# EAGLE design servo-pyro (EAGLE 7.4.0)
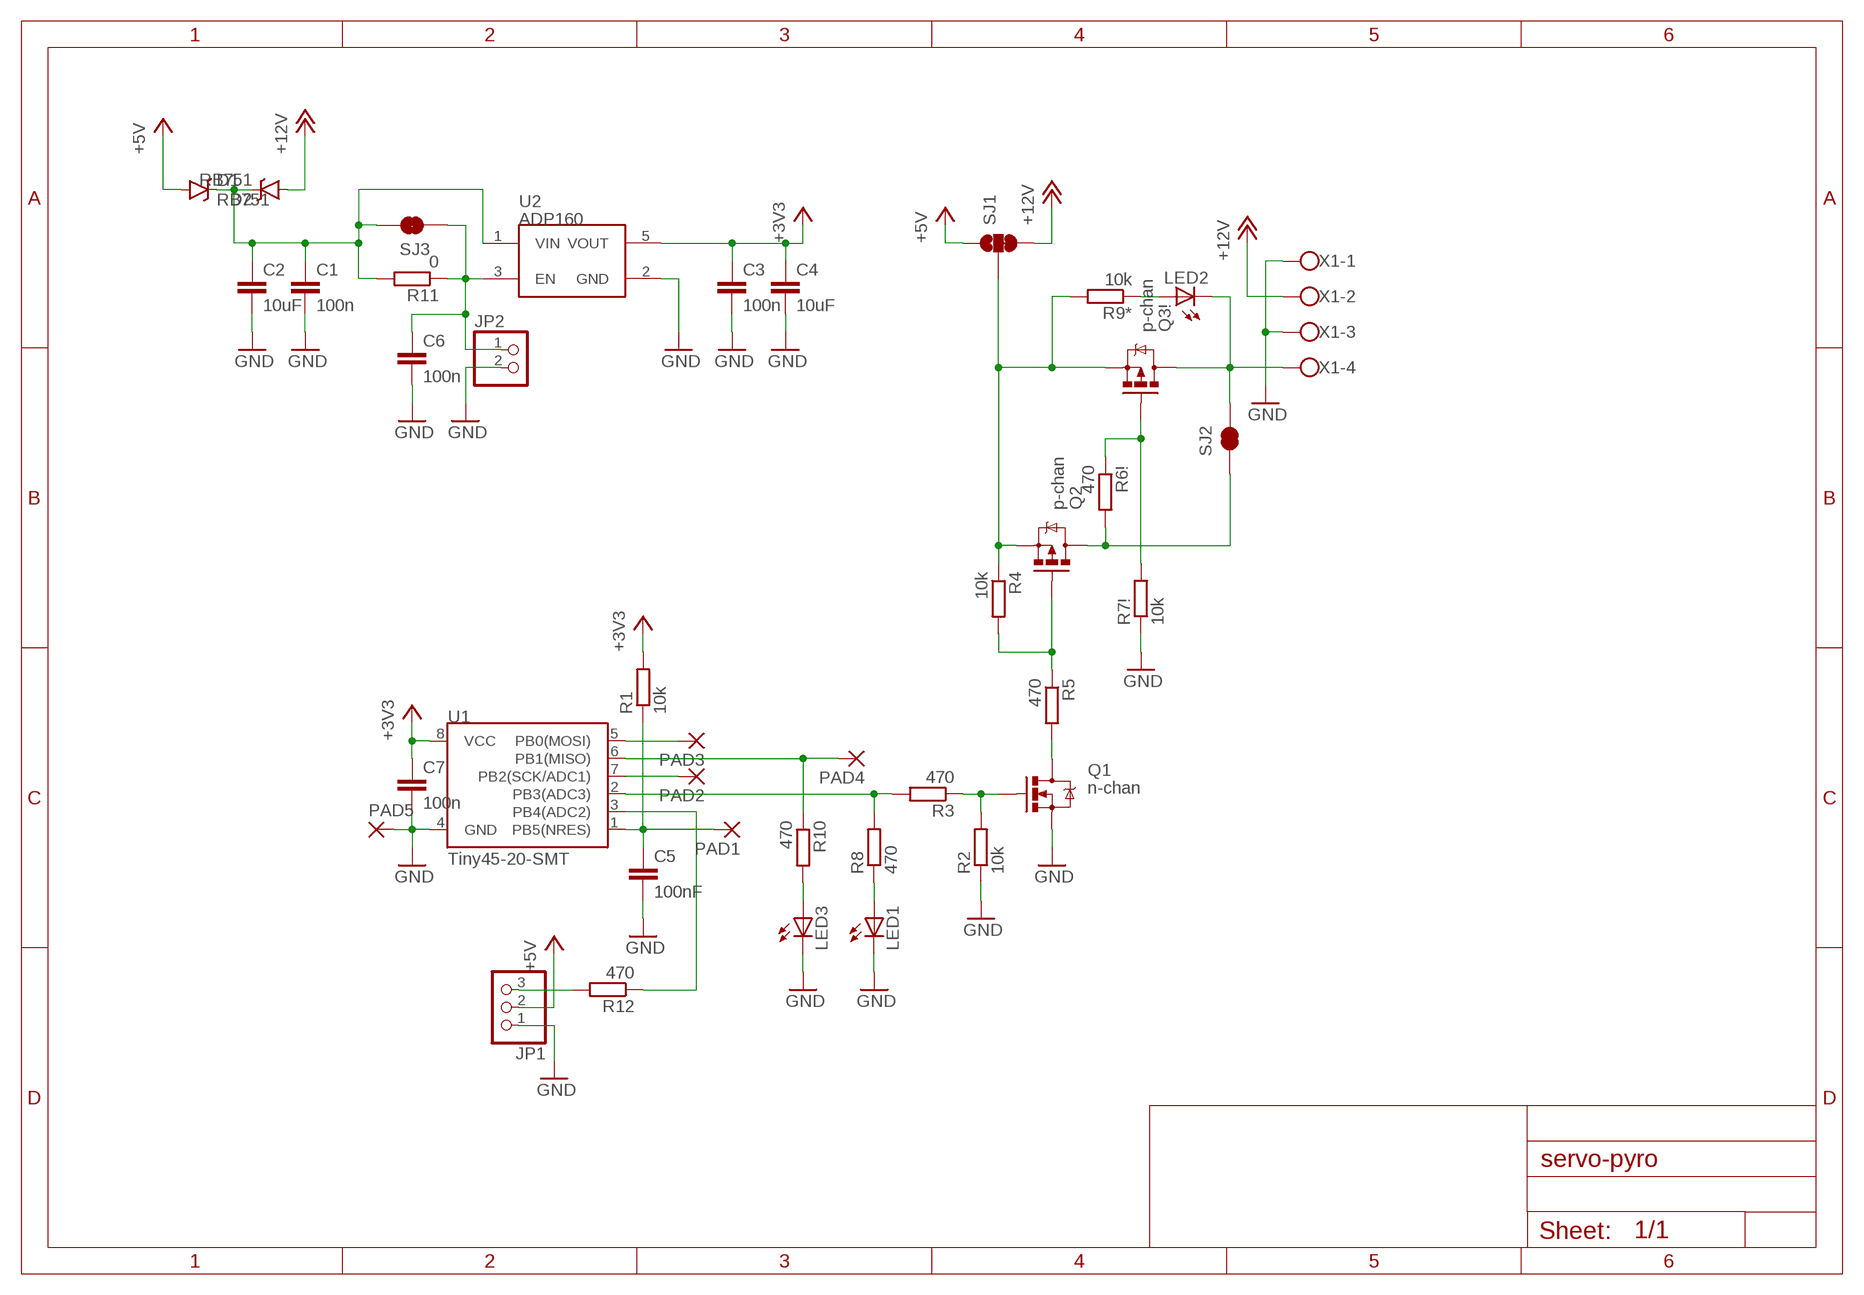
[diagram p0: schematic, sheet 1]

## Parts
C1  100n  C-EUC0603K  [C0603K]
C2  10uF  C-EUC0603K  [C0603K]
C3  100n  C-EUC0603K  [C0603K]
C4  10uF  C-EUC0603K  [C0603K]
C5  100nF  C-EUC0603K  [C0603K]
C6  100n  C-EUC0603K  [C0603K]
C7  100n  C-EUC0603K  [C0603K]
D1  RB751  DIODE-SCHOTTKY-RB751  [SOD-523]
D2  RB751  DIODE-SCHOTTKY-RB751  [SOD-523]
JP1  PINHD-1X3  [1X03]
JP2  PINHD-1X2  [1X02]
LED1  LEDCHIPLED_0603  [CHIPLED_0603]
LED2  LEDCHIPLED_0603  [CHIPLED_0603]
LED3  LEDCHIPLED_0603  [CHIPLED_0603]
PAD1  1,6/0,8  [1,6/0,8]
PAD2  1,6/0,8  [1,6/0,8]
PAD3  1,6/0,8  [1,6/0,8]
PAD4  1,6/0,8  [1,6/0,8]
PAD5  1,6/0,8  [1,6/0,8]
Q1  n-chan  MOSFET-NCHANNELBSS123LT1G  [SOT23-3]
Q2  p-chan  MOSFET-PCHANNELSMD  [SOT23-3]
Q3!  p-chan  MOSFET-PCHANNELSMD  [SOT23-3]
R1  10k  R-EU_R0603  [R0603]
R2  10k  R-EU_R0603  [R0603]
R3  470  R-EU_R0603  [R0603]
R4  10k  R-EU_R0603  [R0603]
R5  470  R-EU_R0603  [R0603]
R6!  470  R-EU_R0603  [R0603]
R7!  10k  R-EU_R0603  [R0603]
R8  470  R-EU_R0603  [R0603]
R9*  10k  R-EU_R0603  [R0603]
R10  470  R-EU_R0603  [R0603]
R11  0  R-EU_R0603  [R0603]
R12  470  R-EU_R0603  [R0603]
SJ1  JUMPER-PAD-3-2OF3_NC_BY_TRACE_LARGE  [PAD-JUMPER-3-2OF3_NC_BY_TRACE_YES_SILK_LARGE]
SJ2  JUMPER-PAD-2-NC_BY_TRACENO_SILK  [PAD-JUMPER-2-NC_BY_TRACE_NO_SILK]
SJ3  JUMPER-PAD-2-NC_BY_TRACENO_SILK  [PAD-JUMPER-2-NC_BY_TRACE_NO_SILK]
U1  Tiny45-20-SMT  ATTINY45TINY45-20-SMT  [SO08-EIAJ]
U2  ADP160  [SOT23-5]
X1  W237-4  [W237-4]

## Nets
+3V3: C3.1 C4.1 C7.1 R1.2 U1.8(VCC) U2.5(VOUT)
+5V: D1.A JP1.2 SJ1.1
+12V: D2.A SJ1.3 X1.2
GND: C1.2 C2.2 C3.2 C4.2 C5.2 C6.2 C7.2 JP1.1 JP2.2 LED1.C LED3.C PAD5.1(P) Q1.2(S) R2.1 R7!.1 U1.4(GND) U2.2(GND) X1.1 X1.3
N$1: C5.1 PAD1.1(P) R1.1 U1.1(PB5(NRES))
N$2: C6.1 JP2.1 R11.1 SJ3.1 U2.3(EN)
N$3: LED2.A R9*.1
N$4: C1.1 C2.1 D1.C D2.C R11.2 SJ3.2 U2.1(VIN)
N$5: PAD2.1(P) U1.7(PB2(SCK/ADC1))
N$6: PAD3.1(P) U1.5(PB0(MOSI))
N$7: Q3!.1(G) R6!.1 R7!.2
N$8: Q2.1(G) R4.2 R5.1
N$11: Q1.1(G) R2.2 R3.1
N$12: Q1.3(D) R5.2
N$16: LED1.A R8.1
N$17: R3.2 R8.2 U1.2(PB3(ADC3))
N$18: LED3.A R10.2
N$19: JP1.3 R12.2
N$20: R12.1 U1.3(PB4(ADC2))
N$21: PAD4.1(P) R10.1 U1.6(PB1(MISO))
PWR_IN: Q2.2(S) Q3!.2(S) R4.1 R9*.2 SJ1.2
PWR_ON: Q2.3(D) R6!.2 SJ2.1
PWR_OUT: LED2.C Q3!.3(D) SJ2.2 X1.4

## Library data of the parts
C1-C7 = rcl:C-EU: CAPACITOR, European symbol
D1 D2 = SparkFun-DiscreteSemi:DIODE-SCHOTTKY: Schottky diodes in SFE's production catalog BAT20J 1A 23V 0.62Vf RB751 120mA 40V 0.37Vf PMEG4005EJ 0.5A 40V 0.42Vf MBRA140 1A 40V 0.5Vf B340A 3A 40V SMA; PROD_ID: DIO-11018
JP1 = pinhead:PINHD-1X3: PIN HEADER
JP2 = pinhead:PINHD-1X2: PIN HEADER
LED1-LED3 = led:LED: LED OSRAM: - CHIPLED LG R971, LG N971, LY N971, LG Q971, LY Q971, LO R971, LY R971 LH N974, LH R974 LS Q976, LO Q976, LY Q976 LO Q996 - Hyper CHIPLED LW Q18S LB Q993, LB Q99A, LB R99A - SideLED LS A670, LO A670, LY A670, LG A670, LP A670 LB A673, LV A673, LT A673, LW A673 LH A674 LY A675 LS A676, LA A676, LO A676, LY A676, LW A676 LS A679, LY A679, LG A679 - Hyper Micro SIDELED® LS Y876, LA Y876, LO Y876, LY Y876 LT Y87S - SmartLED LW L88C, LW L88S LB L89C, LB L89S, LG L890 LS L89K, LO L89K, LY L89K LS L896, LA L896, LO L896, LY L896 - TOPLED LS T670, LO T670, LY T670, LG T670, LP T670 LSG T670, LSP T670, LSY T670, LOP T670, LYG T670 LG T671, LOG T671, LSG T671 LB T673, LV T673, LT T673, LW T673 LH T674 LS T676, LA T676, LO T676, LY T676, LB T676, LH T676, LSB T676, LW T676 LB T67C, LV T67C, LT T67C, LS T67K, LO T67K, LY T67K, LW E67C LS E67B, LA E67B, LO E67B, LY E67B, LB E67C, LV E67C, LT E67C LW T67C LS T679, LY T679, LG T679 LS T770, LO T770, LY T770, LG T770, LP T770 LB T773, LV T773, LT T773, LW T773 LH T774 LS E675, LA E675, LY E675, LS T675 LS T776, LA T776, LO T776, LY T776, LB T776 LHGB T686 LT T68C, LB T68C - Hyper Mini TOPLED® LB M676 - Mini TOPLED Santana® LG M470 LS M47K, LO M47K, LY M47K Source: http://www.osram.convergy.de LUXEON: - LUMILED® LXK2-PW12-R00, LXK2-PW12-S00, LXK2-PW14-U00, LXK2-PW14-V00 LXK2-PM12-R00, LXK2-PM12-S00, LXK2-PM14-U00 LXK2-PE12-Q00, LXK2-PE12-R00, LXK2-PE12-S00, LXK2-PE14-T00, LXK2-PE14-U00 LXK2-PB12-K00, LXK2-PB12-L00, LXK2-PB12-M00, LXK2-PB14-N00, LXK2-PB14-P00, LXK2-PB14-Q00 LXK2-PR12-L00, LXK2-PR12-M00, LXK2-PR14-Q00, LXK2-PR14-R00 LXK2-PD12-Q00, LXK2-PD12-R00, LXK2-PD12-S00 LXK2-PH12-R00, LXK2-PH12-S00 LXK2-PL12-P00, LXK2-PL12-Q00, LXK2-PL12-R00 Source: www.luxeon.com KINGBRIGHT: KA-3528ASYC Source: www.kingbright.com
PAD1-PAD5 = wirepad:1,6/0,8: THROUGH-HOLE PAD
Q1 = SparkFun-DiscreteSemi:MOSFET-NCHANNEL: Common NMOSFET Parts MFG P/N Store ID Prod ID FDD8780 TRANS-09984 SI7820DN TRANS-11055 FDS6630A IC-08089 2N7002PW TRANS-11151 FQP30N06L COM-10213 TRANS-10060 BSS123LT1G TRANS-08345 BSS138 TRANS-00830 BS170 2N7000; PROD_ID: TRANS-08345
Q2 Q3! = SparkFun-DiscreteSemi:MOSFET-PCHANNEL: Generic PMOSFET IRLML2244 - TRANS-11153 (SOT-23 -20V -4.3A) (1.Gate 2.Source 3.Drain) FQP27P06 - COM-10349 <http://www.sparkfun.com/products/10349> (TO-220 -60V -27A) (1.Gate 2.Source 3.Drain)
R1-R5 R6! R7! R8 R9* R10-R12 = rcl:R-EU_: RESISTOR, European symbol
SJ1 = SparkFun-Passives:JUMPER-PAD-3-2OF3_NC_BY_TRACE
SJ2 SJ3 = SparkFun-Passives:JUMPER-PAD-2-NC_BY_TRACE
U1 = SparkFun-DigitalIC:ATTINY45: Atmel 8-pin 2/4/8kB flash uC; PROD_ID: IC-08922
U2 = SparkFun-PowerIC:ADP160: Nanopower LDO Iq less than 1uA for low Iload; PROD_ID: VREG-11306
X1 = con-wago-500:W237-4: WAGO SCREW CLAMP; OC_FARNELL: unknown; OC_NEWARK: unknown

## Board
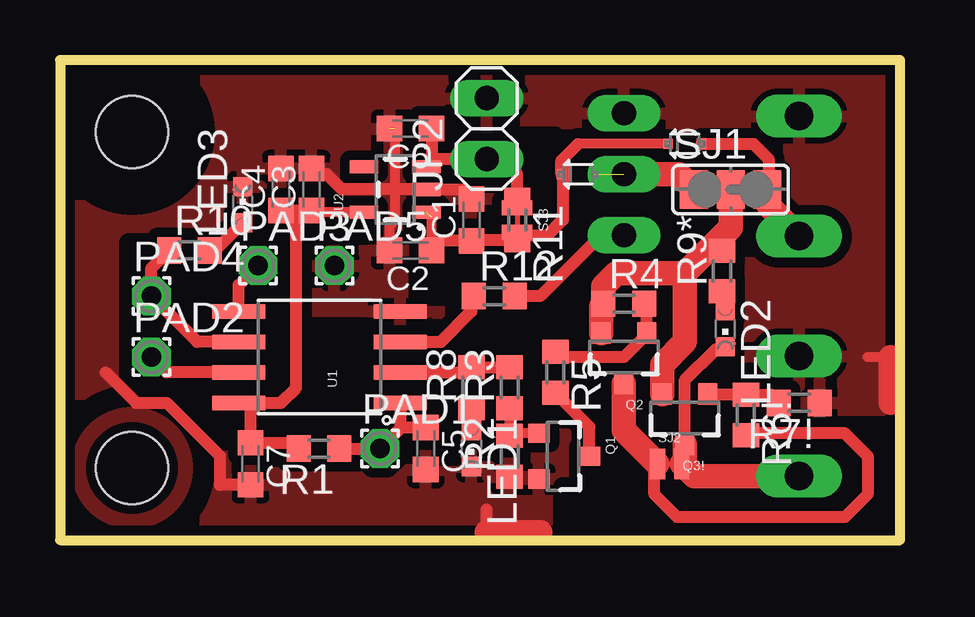
[diagram p1: board, top side]
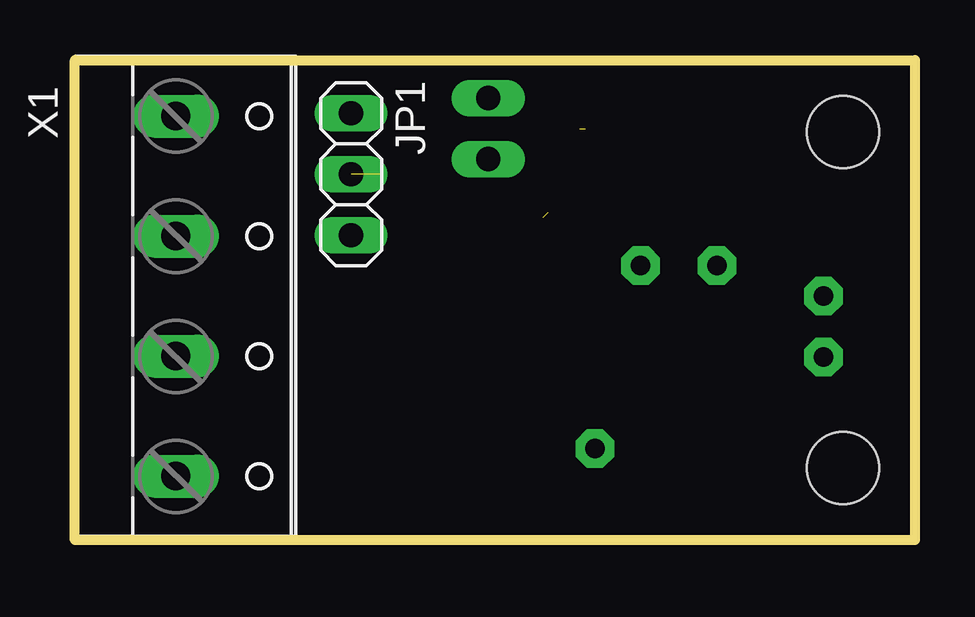
[diagram p2: board, bottom side, seen from below]

Size 35 x 20 mm. Coordinates in mm from the lower left corner, seen from the top.
Outline: 0,0 35,0 35,20 0,20 0,0
Copper layers (1*16): Top 0.035mm / dielectric 1.5mm / Bottom 0.035mm
Design rules "default *": minimum track width 10mil, minimum drill 24mil, track to track 8mil, track to pad 8mil, pad to pad 8mil, via to via 8mil, smd to smd 8mil, copper to edge 10mil, drill to drill 8mil, minimum pad ring 10mil, minimum via ring 8mil, stop-mask expansion 4mil, vias tented up to drill 0mil, thermal gap 10mil
Holes 3 mm at 3,17 3,3
tRestrict: area 0,14 to 6,20; area 0,0 to 6,6; area 10.2,5.7 to 12.7,8.9; area 19.4,15.9 to 20.6,16.8; area 14.3,16.8 to 14.6,17.5; area 10.5,14 to 11.4,14.6; area 15.9,3.5 to 16.5,4.1; area 14.9,10.2 to 16.2,11.1; area 6.3,4.1 to 7.6,5.4; area 2.9,6.3 to 5.1,12.4; area 11.1,12.7 to 12.7,13.3; area 32.7,3.8 to 34.6,4.8; 1 more areas

### Footprints (pad centres in the part's own frame; a part is rotated, then mirrored left to right if it is on the bottom)
C0603K = smd 1.05 x 1.08: 1 -0.875,0; 2 0.875,0
SOD-523 = smd 0.4 x 0.4: A -0.7,0; C 0.7,0
1X03 = drill 1.016 long: 1 -2.54,0; 2 0,0; 3 2.54,0
1X02 = drill 1.016 long: 1 -1.27,0; 2 1.27,0
CHIPLED_0603 = smd 0.8 x 0.8: A 0,-0.75; C 0,0.75
1,6/0,8 = drill 0.813 pad 1.6 octagon: 1 0,0
SOT23-3 = smd 0.8 x 0.9: 1 -0.95,-1; 2 0.95,-1; 3 0,1.1
R0603 = smd 1 x 1.1: 1 -0.85,0; 2 0.85,0
PAD-JUMPER-3-2OF3_NC_BY_TRACE_YES_SILK_LARGE = smd 1.168 x 1.6: 1 -1.524,0; 2 0,0; 3 1.524,0
PAD-JUMPER-2-NC_BY_TRACE_NO_SILK = smd 0.635 x 1.27: 1 -0.508,0; 2 0.508,0
SO08-EIAJ = smd 0.61 x 2.21: 1 -1.905,-3.378; 2 -0.635,-3.378; 3 0.635,-3.378; 4 1.905,-3.378; 5 1.905,3.353; 6 0.635,3.353; 7 -0.635,3.353; 8 -1.905,3.353
SOT23-5 = smd 0.55 x 1.2: 1 -0.95,-1.3; 2 0,-1.3; 3 0.95,-1.3; 4 0.95,1.3; 5 -0.95,1.3
W237-4 = drill 1.194 long: 1 -7.5,-1.27; 2 -2.5,-1.27; 3 2.5,-1.27; 4 7.5,-1.27

### Placement (x,y rotation side)
C1  17.14,13.34 90 top
C2  14.61,12.06 180 top
C3  10.48,14.61 90 top
C4  9.21,14.61 90 top
C5  15.24,3.81 270 top
C6  14.61,17.14 180 top
C7  7.94,3.17 270 top
D1  21.59,15.24 180 top
D2  26.04,16.51 180 top
JP1  23.5,15.24 270 bottom
JP2  17.78,17.14 90 top
LED1  17.14,3.81 180 top
LED2  27.72,8.8 180 top
LED3  7.62,13.97 0 top
PAD1  13.34,3.81 0 top
PAD2  3.81,7.62 0 top
PAD3  8.26,11.43 0 top
PAD4  3.81,10.16 0 top
PAD5  11.43,11.43 0 top
Q1  20.95,3.49 270 top
Q2  23.5,7.62 180 top
Q3!  26.04,5.08 180 top
R1  10.79,3.81 180 top
R2  18.73,3.49 90 top
R3  18.73,6.35 90 top
R4  23.5,9.84 0 top
R5  20.64,6.99 270 top
R6!  28.57,5.21 270 top
R7!  30.8,5.71 180 top
R8  17.14,6.35 90 top
R9*  27.58,11.21 90 top
R10  5.4,12.06 0 top
R11  19.05,13.34 270 top
R12  18.1,10.16 0 top
SJ1  27.94,14.61 0 top
SJ2  25.4,3.17 0 top
SJ3  19.05,13.34 270 top
U1  10.79,7.62 90 top
U2  13.97,14.61 90 top
X1  29.53,10.16 270 bottom

### Tracks (layer width: path | path; a pad name or v marks a point on that pad's centre or on a via)
+3V3
  Top 0.406: U2.5 10.87,13.65 C3.1 9.84,13.73 C4.1
  Top 0.5: R1.2 9.71,4.05 C7.1 7.94,5.71 U1.8 9.21,5.71 9.84,6.35 9.84,13.73
+5V  (1 unrouted)
  Top 1.016: JP1.2 25.78,15.24 SJ1.1
+12V
  Top 0.5: D2.A 28.89,16.51 29.53,15.88 29.53,14.67 SJ1.3
  Top 1.016: 29.53,14.67 29.53,13.93 X1.2
GND  (1 unrouted)
  Top 0.406: 16.75,14.61 C1.2 | C2.2 13.73,13.1 13.97,13.34 13.97,17.14 | 34.61,7.62 33.66,7.62
  Top 0.5: 10.79,15.24 11.11,15.24 11.75,14.61 U2.2 16.75,14.61 | 1.91,6.99 3.17,5.71 4.45,5.71 6.67,3.49 6.67,2.3 C7.2 | 17.78,0.32 17.78,1.27
  Top 1.016: 20,0.32 17.78,0.32 | 34.61,7.62 34.61,5.71
  pour Top (isolate 0.406): -0.64,-0.64 35.56,-0.64 35.56,20.64 -0.64,20.64
N$1
  Top 0.406: 14.21,4.68 14.17,4.65
  Top 0.5: R1.1 PAD1.1 14.17,4.65 U1.1 | C5.1 14.21,4.68
N$2
  Top 0.406: 15.48,15.77 U2.3 15.59,15.88
  Top 0.5: C6.1 15.48,15.77 | 15.59,15.88 JP2.1 18.41,15.88 19.05,15.24 R11.1 SJ3.1
N$3
  Top 0.406: LED2.A 27.71,10.22 R9*.1
N$4  (1 unrouted)
  Top 0.406: 15.48,13.45 C2.1 15.88,12.46 | 17.17,12.48 C1.1 | D2.C 21.59,16.51
  Top 0.5: C1.1 15.88,12.46 | R11.2 17.17,12.48 | 21.59,16.51 20.95,15.88 | 20.95,15.88 20.95,13.34 20.32,12.7 19.27,12.7 R11.2 | SJ3.2 R11.2 | D1.C 20.89,15.81 20.95,15.88
N$5
  Top 0.5: U1.7 4.45,6.99 PAD2.1
N$6
  Top 0.5: U1.5 7.44,10.62 PAD3.1
N$7
  Top 0.5: Q3!.1 28.56,6.08 R6!.1 29.6,6.06 R7!.2
N$8
  Top 0.406: Q2.1 24.45,8.57 | 20.85,7.62 R5.1
  Top 0.5: Q2.1 24.45,9.74 R4.2 | 24.45,8.57 23.5,7.62 20.85,7.62
N$9
  pour Top (isolate 0.01): 7.3,19.37 11.11,19.37 11.11,17.14 7.3,17.14
N$11
  Top 0.406: Q1.1 18.83,4.44 R2.2 R3.1
N$12
  Top 0.5: Q1.3 22.05,4.72 R5.2
N$16
  Top 0.5: R8.1 LED1.A
N$17
  Top 0.5: U1.2 16.93,6.99 R8.2 R3.2
N$18
  Top 0.5: R10.2 6.46,12.06 LED3.A
N$19
  Top 0.5: JP1.3 22.54,12.7 20,10.16 R12.2
N$20
  Top 0.5: U1.3 15.88,8.26 17.14,9.53 17.14,10.06 R12.1
N$21
  Top 0.5: U1.6 5.71,8.26 PAD4.1 3.81,11.33 R10.1
PWR_IN
  Top 0.406: R9*.2 27.58,12.66 27.62,12.7
  Top 1.016: Q3!.2 25.09,7.3 26.04,8.26 26.04,11.11 | 26.04,11.11 27.62,12.7 27.94,13.02 SJ1.2 | 26.04,11.11 23.18,11.11 22.64,10.58 R4.1 22.55,9.74 Q2.2
PWR_ON
  Top 0.5: SJ2.1 24.77,3.05 24.77,1.91 25.72,0.95 32.7,0.95 33.66,1.91 33.66,3.49 32.7,4.45 28.66,4.45 R6!.2
  Top 1.016: Q2.3 23.5,4.57 SJ2.1
PWR_OUT
  Top 0.406: 27.3,7.94 27.61,7.94 LED2.C
  Top 0.5: Q3!.3 26.04,6.67 27.3,7.94
  Top 1.016: Q3!.3 26.04,3.3 SJ2.2 26.42,2.66 X1.4

### Text on the board
tRestrict: TOP